# Altium schematic sheet 发送端V04.SchDoc
size A3
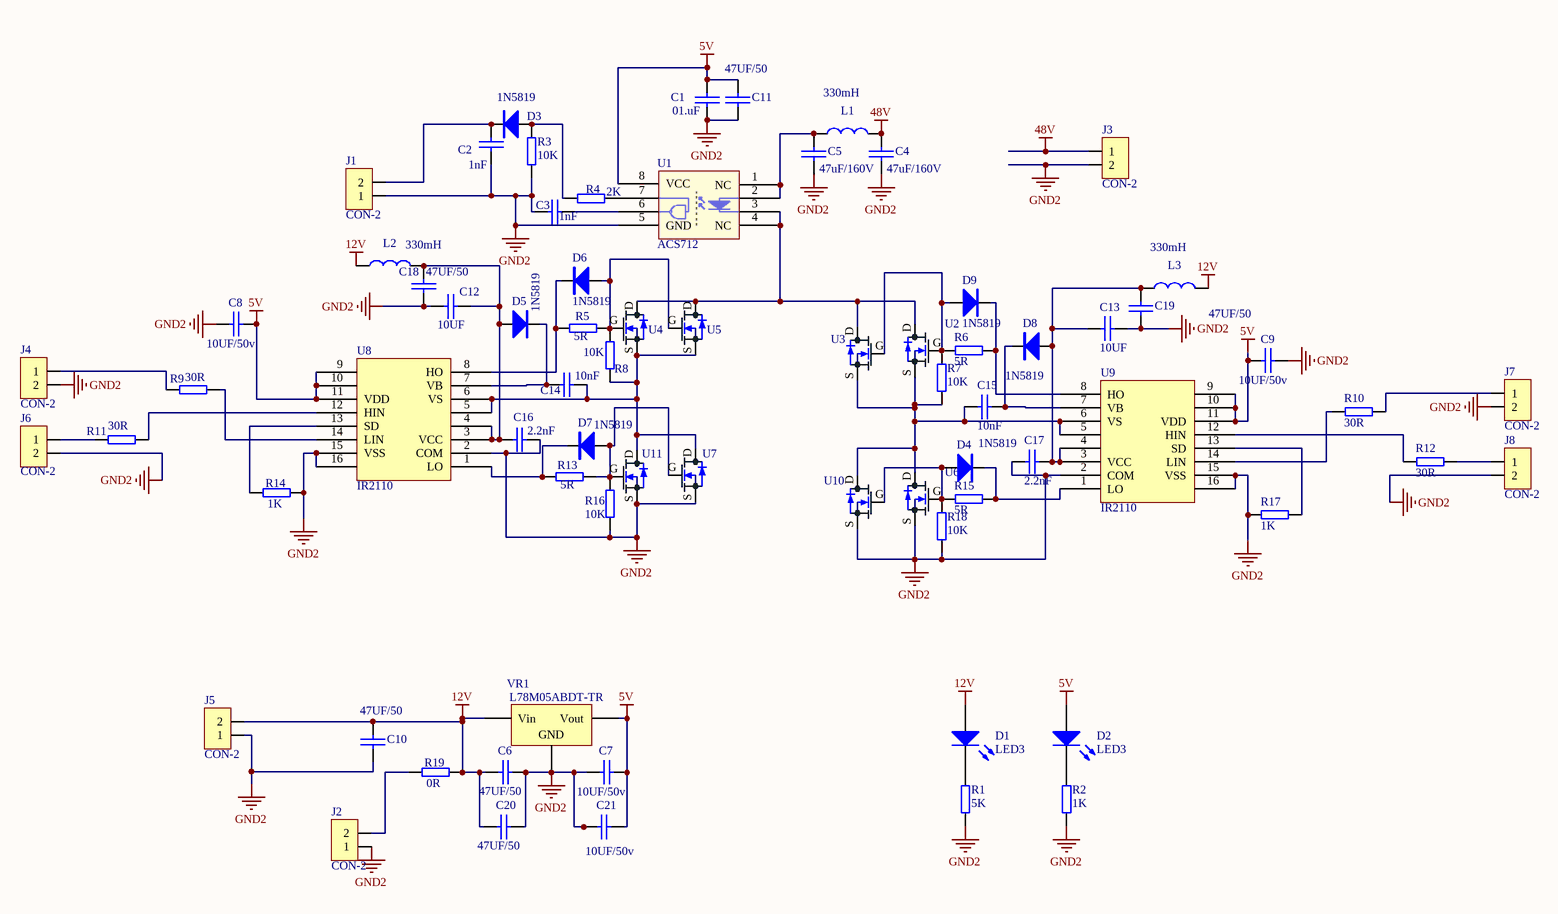
[diagram p0: 发送端V04.SchDoc]

## Parts
C1  01.uF  [1206_C]
C2  1nF  [1206_C]
C3  1nF  [1206_C]
C4  47uF/160V  [C3618]
C5  47uF/160V  [C3618]
C6  47UF/50  [1206_C]
C7  10UF/50v  [1206_C]
C8  10UF/50v  [1206_C]
C9  10UF/50v  [1206_C]
C10  47UF/50  [C1020]
C11  47UF/50  [C1020]
C12  10UF  [1206_C]
C13  10UF  [1206_C]
C14  10nF  [1206_C]
C15  10nF  [1206_C]
C16  2.2nF  [1206_C]
C17  2.2nF  [1206_C]
C18  47UF/50  [C1020]
C19  47UF/50  [C1020]
C20  47UF/50  [1206_C]
C21  10UF/50v  [1206_C]
D1  LED3  [1206_R]
D2  LED3  [1206_R]
D3  1N5819  [1206_R]
D4  1N5819  [1206_R]
D5  1N5819  [1206_R]
D6  1N5819  [1206_R]
D7  1N5819  [1206_R]
D8  1N5819  [1206_R]
D9  1N5819  [1206_R]
J1  CON-2  [HDR1X2]
J2  CON-2  [HDR1X2]
J3  CON-2  [F396P2-1]
J4  CON-2  [GPSPIN]
J5  CON-2  [F396P2-1]
J6  CON-2  [GPSPIN]
J7  CON-2  [GPSPIN]
J8  CON-2  [GPSPIN]
L1  330mH  [H3.3]
L2  330mH  [H3.3]
L3  330mH  [H3.3]
R1  5K  [1206_R]
R2  1K  [1206_R]
R3  10K  [1206_R]
R4  2K  [1206_R]
R5  5R  [1206_R]
R6  5R  [1206_R]
R7  10K  [1206_R]
R8  10K  [1206_R]
R9  30R  [1206_R]
R10  30R  [1206_R]
R11  30R  [1206_R]
R12  30R  [1206_R]
R13  5R  [1206_R]
R14  1K  [1206_R]
R15  5R  [1206_R]
R16  10K  [1206_R]
R17  1K  [1206_R]
R18  10K  [1206_R]
R19  0R  [1206_R]
U1  ACS712  [SOIC-8_150mil]
U2  IKW50N60H3  [TO-220]  (value not drawn)
U3  IKW50N60H3  [DDPak]  (value not drawn)
U4  IKW50N60H3  [TO-220]  (value not drawn)
U5  IKW50N60H3  [DDPak]  (value not drawn)
U6  IRFP4868  [TO-220]  (value not drawn)
U7  IRFP4868  [DDPak]  (value not drawn)
U8  IR2110  [SOIC-16_300mil]
U9  IR2110  [SOIC-16_300mil]
U10  IRFP4868  [DDPak]  (value not drawn)
U11  IRFP4868  [TO-220]  (value not drawn)
VR1  L78M05ABDT-TR  [TO-220]

## Nets
5V: C1.1 C7.1 C8.1 C9.2 C11.1 C21.1 D2.1(A) U1.8(VCC) U8.9 U8.10 U8.11(VDD) U9.9 U9.10 U9.11(VDD) VR1.S(Vout)
12V: C6.2 C10.1 C20.2 D1.1(A) J5.2 L2.2 L3.1 R19.2 VR1.G(Vin)
48V: C4.1 J3.1 L1.1
GND2: C1.2 C2.2 C3.2 C4.2 C5.2 C6.1 C7.2 C8.2 C9.1 C10.2 C11.2 C12.2 C13.2 C16.1 C17.1 C18.2 C19.2 C20.1 C21.2 J1.1 J2.1 J3.2 J4.2 J5.1 J6.2 J7.2 J8.2 R1.1 R2.1 R3.2 R14.2 R16.1 R17.2 R18.1 U1.5(GND) U6.S U7.S U8.2(COM) U8.15(VSS) U8.16 U9.2(COM) U9.15(VSS) U9.16 U10.S U11.S VR1.D(GND)
NetC2_1: C2.1 D3.2(K) J1.2
NetC3_1: C3.1 U1.6(VO)
NetC5_1: C5.1 L1.2 U1.1(NC) U1.2(A)
NetC12_1: C12.1 C16.2 C18.1 D5.1(A) L2.1 U8.3(VCC) U8.4
NetC13_1: C13.1 C17.2 C19.1 D8.1(A) L3.2 U9.3(VCC) U9.4
NetC14_1: C14.1 R8.1 U4.S U5.S U7.D U8.5 U8.6(VS) U11.D
NetC14_2: C14.2 D5.2(K) U8.7(VB)
NetC15_1: C15.1 R7.1 U2.S U3.S U6.D U9.5 U9.6(VS) U10.D
NetC15_2: C15.2 D8.2(K) U9.7(VB)
NetD1_2: D1.2(K) R1.2
NetD2_2: D2.2(K) R2.2
NetD3_1: D3.1(A) R3.1 R4.2
NetD4_1: D4.1(A) R15.2 R18.2 U6.G U10.G
NetD4_2: D4.2(K) R15.1 U9.1(LO)
NetD6_1: D6.1(A) R5.2 R8.2 U4.G U5.G
NetD6_2: D6.2(K) R5.1 U8.8(HO)
NetD7_1: D7.1(A) R13.2 R16.2 U7.G U11.G
NetD7_2: D7.2(K) R13.1 U8.1(LO)
NetD9_1: D9.1(A) R6.2 R7.2 U2.G U3.G
NetD9_2: D9.2(K) R6.1 U9.8(HO)
NetJ2_2: J2.2 R19.1
NetJ4_1: J4.1 R9.1
NetJ6_1: J6.1 R11.1
NetJ7_1: J7.1 R10.1
NetJ8_1: J8.1 R12.1
NetR4_1: R4.1 U1.7(VE)
NetR9_2: R9.2 U8.14(LIN)
NetR10_2: R10.2 U9.14(LIN)
NetR11_2: R11.2 U8.12(HIN)
NetR12_2: R12.2 U9.12(HIN)
NetR14_1: R14.1 U8.13(SD)
NetR17_1: R17.1 U9.13(SD)
NetU1_3: U1.3(K) U1.4(NC) U2.D U3.D U4.D U5.D

## Library data of the parts
C1-C21 = CAP
D1 D2 = LED3: Typical BLUE SiC LED; Published: 8-Jun-2000; LatestRevisionDate: 17-Dec-2003; LatestRevisionNote: PCB Footprint replaced.; DatasheetVersion: 16-Apr-2002; PackageVersion: 16-Apr-2002; PackageReference: 3.5X2.8X1.9; Publisher: Altium Limited; PackageDescription: SM LED; 2 C-Bend Leads; Body 3.5 x 2.8 x 1.9 mm, inc leads (LxWxH typ)
D3-D9 = 1N4148: 1N4148WS IN4148 0805 SOD323 丝印T4 贴片开关二极管
L1-L3 = INL: CD75--2.2mH 222M 贴片功率电感绕线功率电感 7*7.8*5mm
R1-R19 = RES
U1 = 6N137S(TA)_[C16496]: 贴片光耦; ComponentLink1Description: 供应商链接; ComponentLink1URL: http://www.szlcsc.com/product/details_17178.html; Package: SMD-8_6.3mm; Supplier: LC; SuppliersPartNumber: C16496
U2-U7 U10 U11 = NMOS
VR1 = TO-252-2 L78M05ABDT-TR: 低压差线性稳压(LDO); ComponentLink1Description: 供应商链接; ComponentLink1URL: http://www.szlcsc.com/product/details_59107.html; Package: TO-252-2; Supplier: LC; SuppliersPartNumber: C58069